# EAGLE schematic osbo_v11 (EAGLE 7.2.0)
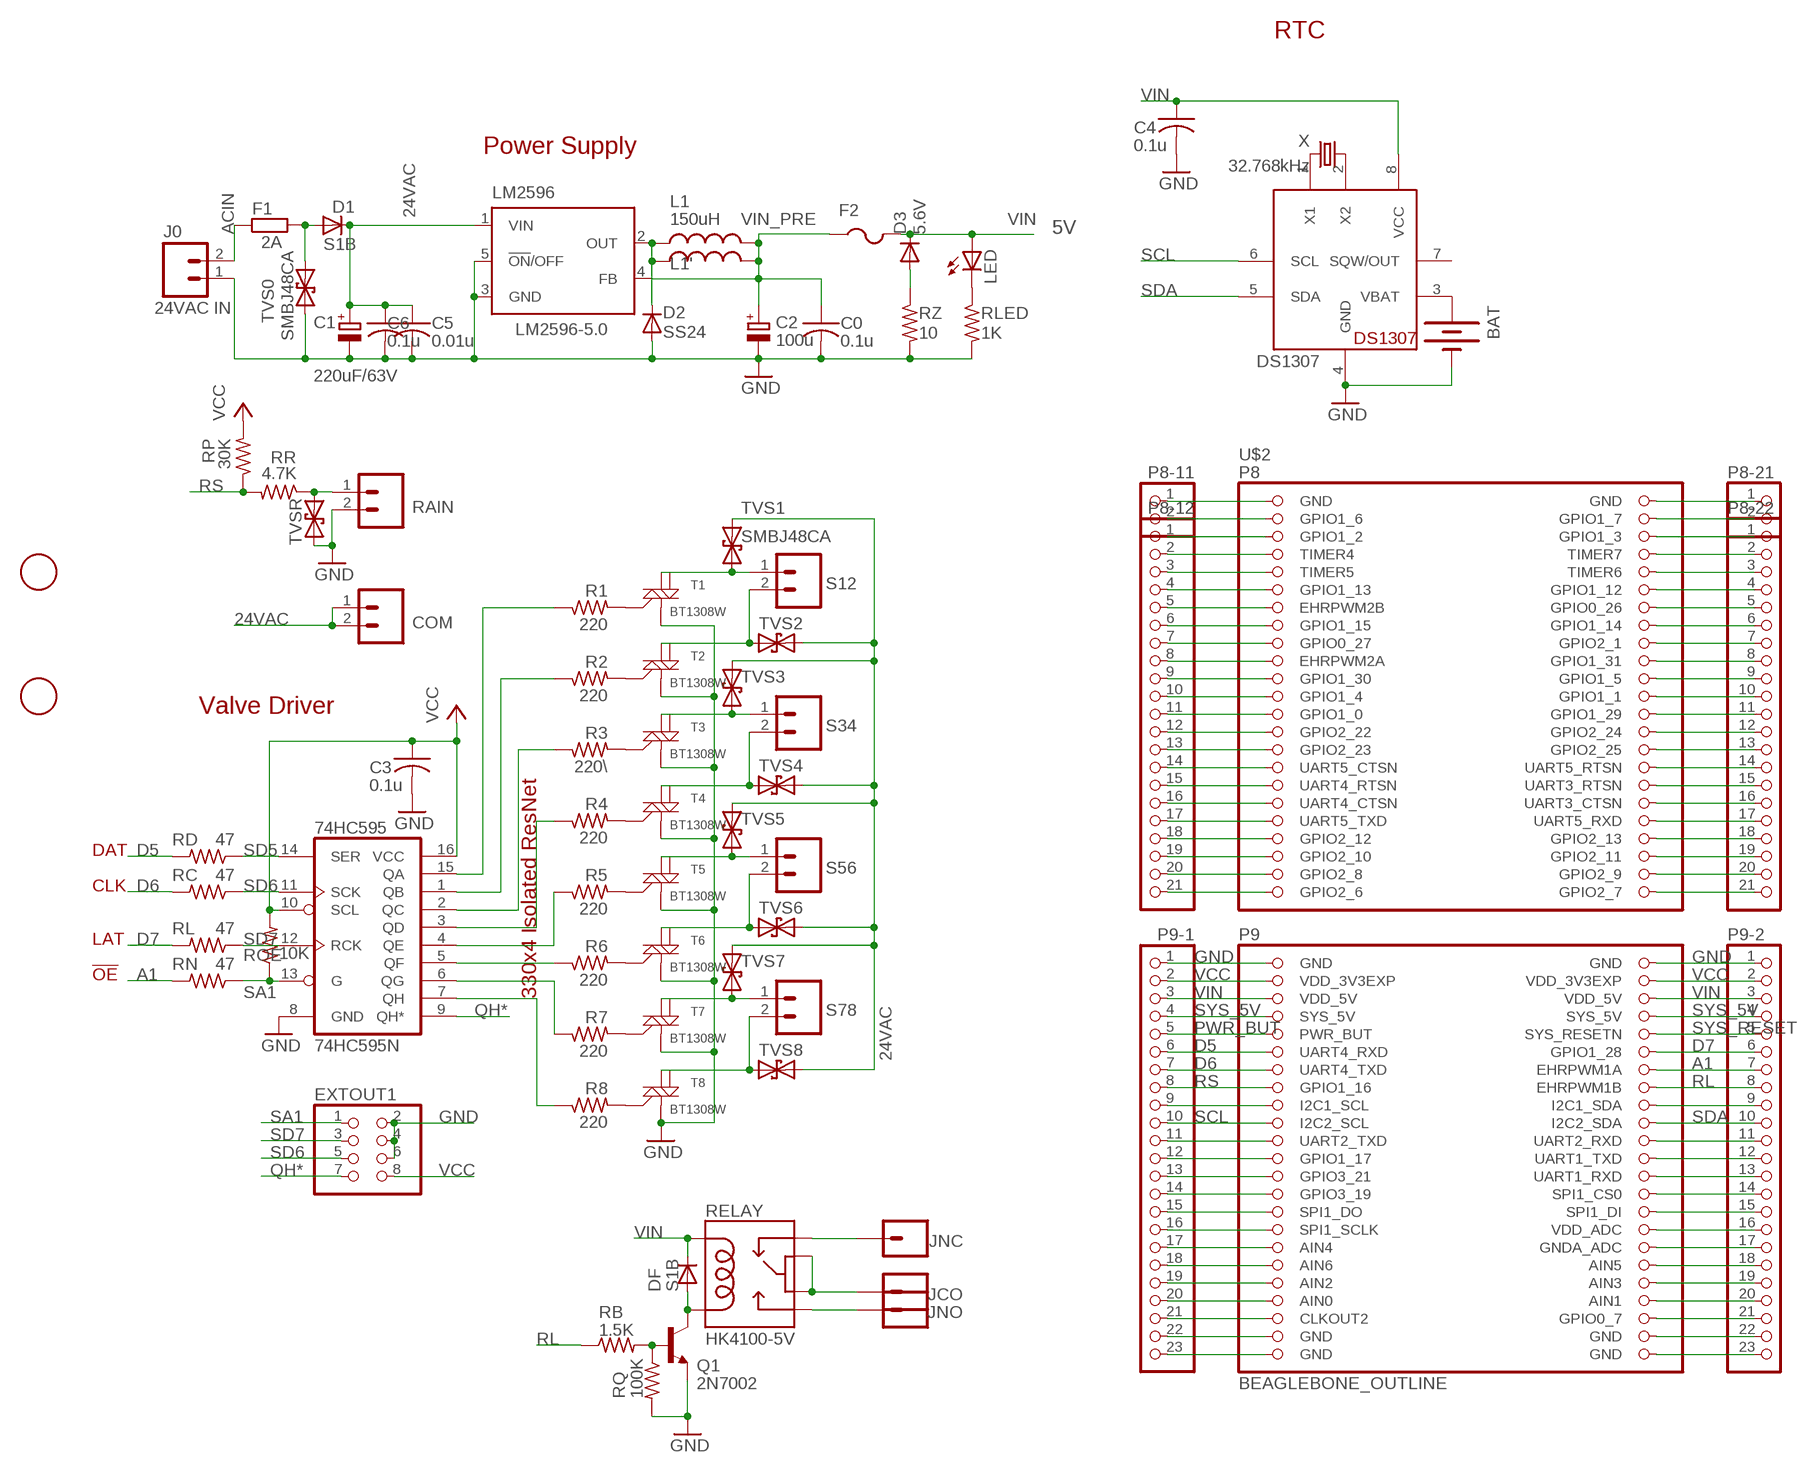
[diagram p0: schematic, sheet 1]

## Parts
74HC595  74HC595N  74LS595D  [SO16]
BAT  BATTERYBATTERY_12MM_SMT  [BATTCON_12MM_SMT]
C0  0.1u  C-USC0805K  [C0805K]
C1  220uF/63V  CPOL-EUE5-10.5-1  [E5-10.5-1]
C2  100u  CPOL-EUE3.5-8  [E3,5-8]
C3  0.1u  C-USC0805K  [C0805K]
C4  0.1u  C-USC0805K  [C0805K]
C5  0.01u  C-USC0805K  [C0805K]
C6  0.1u  C-USC0805K  [C0805K]
COM  M025MM-X  [SCREWTERMINAL-5MM-2-X]
D1  S1B  DIODE-DO-214AC  [DO-214AC]
D2  SS24  DIODE-SMB  [SMB]
D3  5.6V  DIODE-MINIMELF  [MINIMELF]
DF  S1B  DIODE-DO-214AC  [DO-214AC]
DS1307  DS1307  DS1307SOIC  [SO08]
EXTOUT1  PINHD-2X4/90  [2X04/90]
F1  2A  R-EU_0411/3V  [0411V]
F2  PTCFUSE-1812  [1812]
J0  24VAC IN  M024MM-X  [SCREWTERMINAL-4MM-2-X]
JCO  M01PTH  [1X01]
JNC  M01PTH  [1X01]
JNO  M01PTH  [1X01]
L1  150uH  INDUCTORPWR  [CDRH125]
L1'  150uH  L-US0207/7  [0207/7]
LED  LEDCHIPLED_0805  [CHIPLED_0805]
LM2596  LM2596-5.0  LM2596S  [TO263-5]
P8-11  PINHD-1X2  [1X02]
P8-12  PINHD-1X21  [1X21]
P8-21  PINHD-1X2  [1X02]
P8-22  PINHD-1X21  [1X21]
P9-1  PINHD-1X23  [1X23]
P9-2  PINHD-1X23  [1X23]
Q1  2N7002  TRANSISTOR_NPNSOT23-3  [SOT23-3]
R1  220  R-US_R0805  [R0805]
R2  220  R-US_R0805  [R0805]
R3  220\  R-US_R0805  [R0805]
R4  220  R-US_R0805  [R0805]
R5  220  R-US_R0805  [R0805]
R6  220  R-US_R0805  [R0805]
R7  220  R-US_R0805  [R0805]
R8  220  R-US_R0805  [R0805]
RAIN  M025MM-X  [SCREWTERMINAL-5MM-2-X]
RB  1.5K  R-US_R0805  [R0805]
RC  47  R-US_R0805  [R0805]
RD  47  R-US_R0805  [R0805]
RELAY  HK4100-5V  RELAY-2  [RELAY-HK4100F]
RL  47  R-US_R0805  [R0805]
RLED  1K  R-US_R0805  [R0805]
RN  47  R-US_R0805  [R0805]
ROE  10K  R-US_R0805  [R0805]
RP  30K  R-US_R0805  [R0805]
RQ  100K  R-US_R0805  [R0805]
RR  4.7K  R-US_R0805  [R0805]
RZ  10  R-US_R0805  [R0805]
S12  M025MM-X  [SCREWTERMINAL-5MM-2-X]
S34  M025MM-X  [SCREWTERMINAL-5MM-2-X]
S56  M025MM-X  [SCREWTERMINAL-5MM-2-X]
S78  M025MM-X  [SCREWTERMINAL-5MM-2-X]
T1  BT1308W  MAC97SOT223  [SOT223]
T2  BT1308W  MAC97SOT223  [SOT223]
T3  BT1308W  MAC97SOT223  [SOT223]
T4  BT1308W  MAC97SOT223  [SOT223]
T5  BT1308W  MAC97SOT223  [SOT223]
T6  BT1308W  MAC97SOT223  [SOT223]
T7  BT1308W  MAC97SOT223  [SOT223]
T8  BT1308W  MAC97SOT223  [SOT223]
TVS0  SMBJ48CA  TVSSMB  [SMB]
TVS1  SMBJ48CA  TVSSMB  [SMB]
TVS2  TVSSMB  [SMB]
TVS3  TVSSMB  [SMB]
TVS4  TVSSMB  [SMB]
TVS5  TVSSMB  [SMB]
TVS6  TVSSMB  [SMB]
TVS7  TVSSMB  [SMB]
TVS8  TVSSMB  [SMB]
TVSR  TVSSMB  [SMB]
U$1  FIDUCIAL  [FIDUCIAL_1MM]
U$2  BEAGLEBONE_OUTLINE  [BEAGLEBONE_SHIELD]
U$3  FIDUCIAL  [FIDUCIAL_1MM]
X  32.768kHz  CRYSTALTC38H  [TC38H]

## Nets
24VAC [power]: COM.1 COM.2 D1.A F1.2 TVS0.C TVS1.C TVS2.C TVS3.C TVS4.C TVS5.C TVS6.C TVS7.C TVS8.C
A1: P9-2.7 RN.2 U$2.60(EHRPWM1A)
ACIN [power]: F1.1 J0.2
CO [relay power]: JCO.1 RELAY.5 RELAY.6
D5: P9-1.6 RD.2 U$2.57(UART4_RXD)
D6: P9-1.7 RC.2 U$2.59(UART4_TXD)
D7: P9-2.6 RL.2 U$2.58(GPIO1_28)
GND [power]: 74HC595.8(GND) BAT.P$1(-) C0.2 C1.- C2.- C3.2 C4.2 C5.2 C6.2 D2.A DS1307.4(GND) EXTOUT1.2 EXTOUT1.4 EXTOUT1.6 J0.1 LM2596.3(GND) LM2596.5(!ON!/OFF) P8-11.1 P8-21.1 P9-1.1 P9-2.1 Q1.2(E) RAIN.2 RLED.2 RQ.2 RZ.2 T1.1(M1) T2.1(M1) T3.1(M1) T4.1(M1) T5.1(M1) T6.1(M1) T7.1(M1) T8.1(M1) TVS0.A TVSR.A U$2.1(GND) U$2.2(GND) U$2.47(GND) U$2.48(GND)
N$1: LED.C RLED.1
N$2 [relay power]: C1.+ C5.1 C6.1 D1.C LM2596.1(VIN)
N$3: R1.2 T1.3(G)
N$4: 74HC595.5(QF) R6.1
N$5: 74HC595.6(QG) R7.1
N$6: D3.A RZ.1
N$7: 74HC595.7(QH) R8.1
N$8 [power]: D2.C L1'.1 L1.1 LM2596.2(OUT)
N$9: DS1307.1(X1) X.2
N$10: 74HC595.4(QE) R5.1
N$11: 74HC595.3(QD) R4.1
N$12: 74HC595.2(QC) R3.1
N$13: 74HC595.1(QB) R2.1
N$14: 74HC595.15(QA) R1.1
N$15: R2.2 T2.3(G)
N$16 [power]: S12.1 T1.2(M2) TVS1.A
N$17 [power]: S12.2 T2.2(M2) TVS2.A
N$18 [power]: S34.1 T3.2(M2) TVS3.A
N$19: R3.2 T3.3(G)
N$20 [power]: S34.2 T4.2(M2) TVS4.A
N$21: R4.2 T4.3(G)
N$22 [power]: S56.1 T5.2(M2) TVS5.A
N$23 [power]: S56.2 T6.2(M2) TVS6.A
N$24 [power]: S78.1 T7.2(M2) TVS7.A
N$25 [power]: S78.2 T8.2(M2) TVS8.A
N$26: R5.2 T5.3(G)
N$27: R6.2 T6.3(G)
N$28: R7.2 T7.3(G)
N$29: R8.2 T8.3(G)
N$30: DS1307.2(X2) X.1
N$31: RAIN.1 RR.1 TVSR.C
N$32: Q1.1(B) RB.2 RQ.1
N$34: P8-11.2 U$2.3(GPIO1_6)
N$35: P8-12.1 U$2.5(GPIO1_2)
N$36: BAT.P$2(+) DS1307.3(VBAT)
N$37: P8-12.2 U$2.7(TIMER4)
N$38: P8-12.3 U$2.9(TIMER5)
N$39: P8-12.4 U$2.11(GPIO1_13)
N$40: P8-12.5 U$2.13(EHRPWM2B)
N$41: P8-12.6 U$2.15(GPIO1_15)
N$42: P8-12.7 U$2.17(GPIO0_27)
N$43: P8-12.8 U$2.19(EHRPWM2A)
N$44: P8-12.9 U$2.21(GPIO1_30)
N$45: P8-12.10 U$2.23(GPIO1_4)
N$46: P8-12.11 U$2.25(GPIO1_0)
N$47: P8-12.12 U$2.27(GPIO2_22)
N$48: P8-12.13 U$2.29(GPIO2_23)
N$49: P8-12.14 U$2.31(UART5_CTSN)
N$50: P8-12.15 U$2.33(UART4_RTSN)
N$51: P8-12.16 U$2.35(UART4_CTSN)
N$52: P8-12.17 U$2.37(UART5_TXD)
N$53: P8-12.18 U$2.39(GPIO2_12)
N$54: P8-12.19 U$2.41(GPIO2_10)
N$55: P8-12.20 U$2.43(GPIO2_8)
N$56: P8-12.21 U$2.45(GPIO2_6)
N$58: P8-21.2 U$2.4(GPIO1_7)
N$59: P8-22.1 U$2.6(GPIO1_3)
N$60: P8-22.2 U$2.8(TIMER7)
N$61: P8-22.3 U$2.10(TIMER6)
N$62: P8-22.4 U$2.12(GPIO1_12)
N$63: P8-22.5 U$2.14(GPIO0_26)
N$64: P8-22.6 U$2.16(GPIO1_14)
N$65: P8-22.7 U$2.18(GPIO2_1)
N$66: P8-22.8 U$2.20(GPIO1_31)
N$67: P8-22.9 U$2.22(GPIO1_5)
N$68: P8-22.10 U$2.24(GPIO1_1)
N$69: P8-22.11 U$2.26(GPIO1_29)
N$70: P8-22.12 U$2.28(GPIO2_24)
N$71: P8-22.13 U$2.30(GPIO2_25)
N$72: P8-22.14 U$2.32(UART5_RTSN)
N$73: P8-22.15 U$2.34(UART3_RTSN)
N$74: P8-22.16 U$2.36(UART3_CTSN)
N$75: P8-22.17 U$2.38(UART5_RXD)
N$76: P8-22.18 U$2.40(GPIO2_13)
N$77 [power]: DF.A Q1.3(C) RELAY.9
N$78: P8-22.19 U$2.42(GPIO2_11)
N$79: P8-22.20 U$2.44(GPIO2_9)
N$80: P8-22.21 U$2.46(GPIO2_7)
N$89: P9-1.9 U$2.63(I2C1_SCL)
N$91: P9-1.11 U$2.67(UART2_TXD)
N$92: P9-1.12 U$2.69(GPIO1_17)
N$93: P9-1.13 U$2.71(GPIO3_21)
N$94: P9-1.14 U$2.73(GPIO3_19)
N$95: P9-1.15 U$2.75(SPI1_DO)
N$96: P9-1.16 U$2.77(SPI1_SCLK)
N$97: P9-1.17 U$2.79(AIN4)
N$98: P9-1.18 U$2.81(AIN6)
N$99: P9-1.19 U$2.83(AIN2)
N$100: P9-1.20 U$2.85(AIN0)
N$101: P9-1.21 U$2.87(CLKOUT2)
N$102: P9-1.22 U$2.89(GND)
N$103: P9-1.23 U$2.91(GND)
N$112: P9-2.9 U$2.64(I2C1_SDA)
N$114: P9-2.11 U$2.68(UART2_RXD)
N$115: P9-2.12 U$2.70(UART1_TXD)
N$116: P9-2.13 U$2.72(UART1_RXD)
N$117: P9-2.14 U$2.74(SPI1_CS0)
N$118: P9-2.15 U$2.76(SPI1_DI)
N$119: P9-2.16 U$2.78(VDD_ADC)
N$120: P9-2.17 U$2.80(GNDA_ADC)
N$121: P9-2.18 U$2.82(AIN5)
N$122: P9-2.19 U$2.84(AIN3)
N$123: P9-2.20 U$2.86(AIN1)
N$124: P9-2.21 U$2.88(GPIO0_7)
N$125: P9-2.22 U$2.90(GND)
N$126: P9-2.23 U$2.92(GND)
NC [relay power]: JNC.1 RELAY.1
NO [relay power]: JNO.1 RELAY.10
PWR_BUT: P9-1.5 U$2.55(PWR_BUT)
QH*: 74HC595.9(QH*) EXTOUT1.7
RL: P9-2.8 RB.1 U$2.62(EHRPWM1B)
RS: P9-1.8 RP.1 RR.2 U$2.61(GPIO1_16)
SA1: 74HC595.13(G) EXTOUT1.1 RN.1 ROE.1
SCL: DS1307.6(SCL) P9-1.10 U$2.65(I2C2_SCL)
SD5: 74HC595.14(SER) RD.1
SD6: 74HC595.11(SCK) EXTOUT1.5 RC.1
SD7: 74HC595.12(RCK) EXTOUT1.3 RL.1
SDA: DS1307.5(SDA) P9-2.10 U$2.66(I2C2_SDA)
SYS_5V: P9-1.4 P9-2.4 U$2.53(SYS_5V) U$2.54(SYS_5V)
SYS_RESET: P9-2.5 U$2.56(SYS_RESETN)
VCC: 74HC595.10(SCL) 74HC595.16(VCC) C3.1 EXTOUT1.8 P9-1.2 P9-2.2 ROE.2 RP.2 U$2.49(VDD_3V3EXP) U$2.50(VDD_3V3EXP)
VIN [power]: C4.1 D3.C DF.C DS1307.8(VCC) F2.2 LED.A P9-1.3 P9-2.3 RELAY.2 U$2.51(VDD_5V) U$2.52(VDD_5V)
VIN_PRE [power]: C0.1 C2.+ F2.1 L1'.2 L1.2 LM2596.4(FB)
Unconnected: DS1307.7(SQW/OUT) T1.4(M2-4) T2.4(M2-4) T3.4(M2-4) T4.4(M2-4) T5.4(M2-4) T6.4(M2-4) T7.4(M2-4) T8.4(M2-4)

## Notes on the sheet
- RTC
- Power Supply
- 5V
- Valve Driver
- DAT
- CLK
- LAT
- !OE
- 330x4 Isolated ResNet

## Library data of the parts
74HC595 = SparkFun:74*595: 8-bit SHIFT REGISTER, output latch
BAT = SparkFunNew:BATTERY: Battery Holders Various common sizes : AA, AAA, 20mm coin cell and 12mm coin cell.
C0 C3-C6 = adafruit:C-US: CAPACITOR, American symbol
C1 C2 = resistor:CPOL-EU: POLARIZED CAPACITOR, European symbol
COM J0 RAIN S12 S34 S56 S78 = SparkFun:M02: Header 2 Standard 2-pin 0.1" header. Use with straight break away headers (SKU : PRT-00116), right angle break away headers (PRT-00553), swiss pins (PRT-00743), machine pins (PRT-00117), and female headers (PRT-00115). Molex polarized connector foot print use with SKU : PRT-08233 with associated crimp pins and housings.
D1-D3 DF = diode:DIODE-: DIODE
DS1307 = adafruit:DS1307: DS1307 Real time clock (RTC) with battery backup ability. Talk to it via i2c
EXTOUT1 = pinhead:PINHD-2X4: PIN HEADER
F1 = rcl:R-EU_: RESISTOR, European symbol
F2 = adafruit:PTCFUSE: PTC fuses, resettable thermistors
JCO JNC JNO = SparkFun:M01: Header 1 Standard 1-pin 0.1" header. Use with straight break away headers (SKU : PRT-00116), right angle break away headers (PRT-00553), swiss pins (PRT-00743), machine pins (PRT-00117), and female headers (PRT-00115).
L1 = SparkFunNew:INDUCTOR: Inductors Basic Inductor/Choke - 0603 and 1206. Footprints are not proven and vary greatly between part numbers.
L1' = rcl:L-US: INDUCTOR, American symbol
LED = adafruit:LED: LED OSRAM: - CHIPLED LG R971, LG N971, LY N971, LG Q971, LY Q971, LO R971, LY R971 LH N974, LH R974 LS Q976, LO Q976, LY Q976 LO Q996 - Hyper CHIPLED LW Q18S LB Q993, LB Q99A, LB R99A - SideLED LS A670, LO A670, LY A670, LG A670, LP A670 LB A673, LV A673, LT A673, LW A673 LH A674 LY A675 LS A676, LA A676, LO A676, LY A676, LW A676 LS A679, LY A679, LG A679 - Hyper Micro SIDELED® LS Y876, LA Y876, LO Y876, LY Y876 LT Y87S - SmartLED LW L88C, LW L88S LB L89C, LB L89S, LG L890 LS L89K, LO L89K, LY L89K LS L896, LA L896, LO L896, LY L896 - TOPLED LS T670, LO T670, LY T670, LG T670, LP T670 LSG T670, LSP T670, LSY T670, LOP T670, LYG T670 LG T671, LOG T671, LSG T671 LB T673, LV T673, LT T673, LW T673 LH T674 LS T676, LA T676, LO T676, LY T676, LB T676, LH T676, LSB T676, LW T676 LB T67C, LV T67C, LT T67C, LS T67K, LO T67K, LY T67K, LW E67C LS E67B, LA E67B, LO E67B, LY E67B, LB E67C, LV E67C, LT E67C LW T67C LS T679, LY T679, LG T679 LS T770, LO T770, LY T770, LG T770, LP T770 LB T773, LV T773, LT T773, LW T773 LH T774 LS E675, LA E675, LY E675, LS T675 LS T776, LA T776, LO T776, LY T776, LB T776 LHGB T686 LT T68C, LB T68C - Hyper Mini TOPLED® LB M676 - Mini TOPLED Santana® LG M470 LS M47K, LO M47K, LY M47K Source: http://www.osram.convergy.de/
LM2596 = national-semiconductor:LM2596: SIMPLE SWITCHER® Power Converter 150 kHz 3A Step-Down Voltage Regulator Source: http://www.national.com/ds/LM/LM2596.pdf; MF: NATIONAL SEMICONDUCTOR; MPN: LM2596S-ADJ/NOPB; OC_FARNELL: 9494367; OC_NEWARK: 41K3842
P8-11 P8-21 = pinhead:PINHD-1X2: PIN HEADER
P8-12 P8-22 = pinhead:PINHD-1X21: PIN HEADER
P9-1 P9-2 = pinhead:PINHD-1X23: Pin Header
Q1 = SparkFunNew:TRANSISTOR_NPN: Transistor NPN BJT configuration in SOT23 package. MMBT2222 is the common NPN we use. Double check BCE configuration again layout.
R1-R8 RB RC RD RL RLED RN ROE RP RQ RR RZ = adafruit2013:R-US_: RESISTOR, American symbol
RELAY = SparkFunNew:RELAY-2
T1-T8 = SparkFun:MAC97: MAC97 Triac http://www.onsemi.com/pub_link/Collateral/MAC97-D.PDF
TVS0 TVS1-TVS8 TVSR = SparkFunNew:TVS
U$1 U$3 = adafruitGood:FIDUCIAL: For use by pick and place machines to calibrate the vision/machine, 1mm By microbuilder.eu
U$2 = adafruit2013:BEAGLEBONE_OUTLINE: Should match A3 pinout - but not completely tested
X = crystal:CRYSTAL: CRYSTAL; OC_FARNELL: unknown; OC_NEWARK: unknown

## Net classes
0 default: width 0.203 mm, clearance 0.203 mm
1 power: width 0.305 mm, clearance 0.254 mm
2 relay power: width 0.406 mm, clearance 0.254 mm